# EAGLE schematic ADC (EAGLE 6.4)
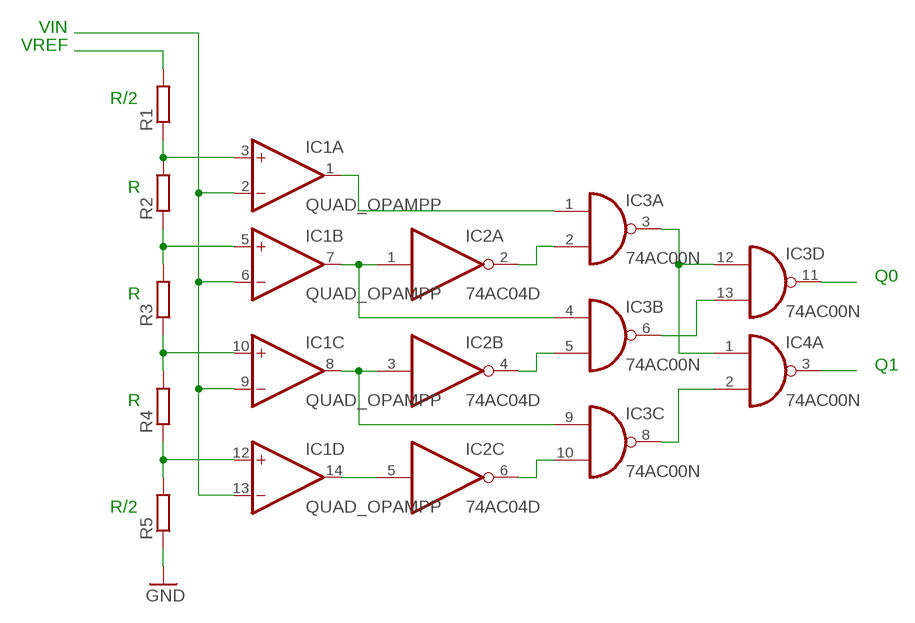
[diagram p0: schematic, sheet 1]

## Parts
IC1  QUAD_OPAMPP  [DIL14]
IC2  74AC04D  [SO14]
IC3  74AC00N  [DIL14]
IC4  74AC00N  [DIL14]
R1  R-EU_0207/15  [0207/15]
R2  R-EU_0207/15  [0207/15]
R3  R-EU_0207/15  [0207/15]
R4  R-EU_0207/15  [0207/15]
R5  R-EU_0207/15  [0207/15]

## Nets
GND: R5.1
N$1: IC1.2(A:-IN) IC1.6(B:-IN) IC1.9(C:-IN) IC1.13(D:-IN)
N$2: IC1.3(A:+IN) R1.1 R2.2
N$3: IC1.5(B:+IN) R2.1 R3.2
N$4: IC1.10(C:+IN) R3.1 R4.2
N$5: IC1.12(D:+IN) R4.1 R5.2
N$6: IC1.14(D:OUT) IC2.5(C:I)
N$7: IC2.2(A:O) IC3.2(A:I1)
N$8: IC1.8(C:OUT) IC2.3(B:I) IC3.9(C:I0)
N$9: IC1.7(B:OUT) IC2.1(A:I) IC3.4(B:I0)
N$10: IC1.1(A:OUT) IC3.1(A:I0)
N$11: IC2.4(B:O) IC3.5(B:I1)
N$12: IC2.6(C:O) IC3.10(C:I1)
N$13: IC3.3(A:O) IC3.12(D:I0) IC4.1(A:I0)
N$14: IC3.8(C:O) IC4.2(A:I1)
N$15: IC3.6(B:O) IC3.13(D:I1)
N$16: R1.2
N$17: IC3.11(D:O)
N$18: IC4.3(A:O)
Unconnected: IC2.8(D:O) IC2.9(D:I) IC2.10(E:O) IC2.11(E:I) IC2.12(F:O) IC2.13(F:I) IC4.4(B:I0) IC4.5(B:I1) IC4.6(B:O) IC4.8(C:O) IC4.9(C:I0) IC4.10(C:I1) IC4.11(D:O) IC4.12(D:I0) IC4.13(D:I1)

## Notes on the sheet
- VIN
- VREF
- R/2
- R
- Q0
- R
- Q1
- R
- R/2

## Power pins joined to a net without a drawn wire
GND: IC2.7(P:GND) IC3.7(P:GND) IC4.7(P:GND)
V+: IC1.4(P:V+)
V-: IC1.11(P:V-)
VCC: IC2.14(P:VCC) IC3.14(P:VCC) IC4.14(P:VCC)

## Library data of the parts
IC1 = adafruit:QUAD_OPAMP: OP AMP Standard quad package
IC2 = 74xx-eu:74*04: Hex INVERTER
IC3 IC4 = 74xx-eu:74*00: Quad 2-input NAND gate
R1-R5 = rcl:R-EU_: RESISTOR, European symbol